# EAGLE design button_sensor_side (EAGLE 9.3.0)
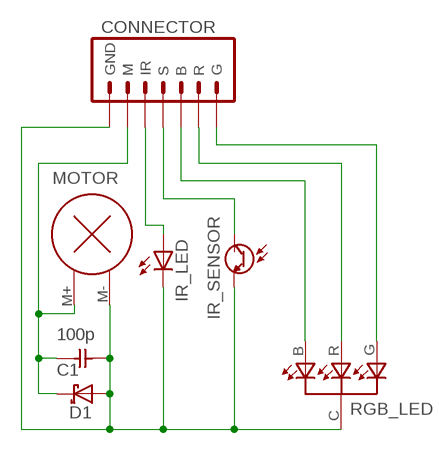
[diagram p0: schematic, sheet 1]

## Parts
C1  100p  CAPACITORSMD_0805  [C0805]
CONNECTOR  CONNECTOR_PADS  [CONNECTOR_PADS]
D1  DIODE_SCHOTTKY  [NSR0530HT1G_SCHOTTKY_DIODE]
IR_LED  TCR5000_EMITTER  [TCR5000_IR_EMITTER]
IR_SENSOR  TCR5000_SENSOR  [TCR5000_IR_SENSOR]
MOTOR  VIBRATION_MOTOR  [VIBRATION_MOTOR]
RGB_LED  APTF1616SEJ3ZGGVBDC_RBG_LED_SMT  [APTF1616SEJ3ZGGVBDC_RGB_LED_SMT]

## Nets
GND: C1.2 CONNECTOR.GND CONNECTOR.GND_(GND) D1.A IR_LED.C IR_SENSOR.E MOTOR.M-(-) RGB_LED.C
N$1: C1.1 CONNECTOR.M D1.C MOTOR.M+(+)
N$3: CONNECTOR.S IR_SENSOR.C
N$4: CONNECTOR.IR IR_LED.A
N$5: CONNECTOR.B RGB_LED.B(BLUE)
N$6: CONNECTOR.R RGB_LED.R(RED)
N$7: CONNECTOR.G RGB_LED.G(GREEN)

## Library data of the parts
C1 = Skinner_Box_Devices:CAPACITOR
CONNECTOR = Skinner_Box_Devices:CONNECTOR_PADS
D1 = Skinner_Box_Devices:DIODE_SCHOTTKY
IR_LED = Skinner_Box_Devices:TCR5000_EMITTER
IR_SENSOR = Skinner_Box_Devices:TCR5000_SENSOR
MOTOR = Skinner_Box_Devices:VIBRATION_MOTOR
RGB_LED = Skinner_Box_Devices:APTF1616SEJ3ZGGVBDC_RBG_LED_SMT

## Board
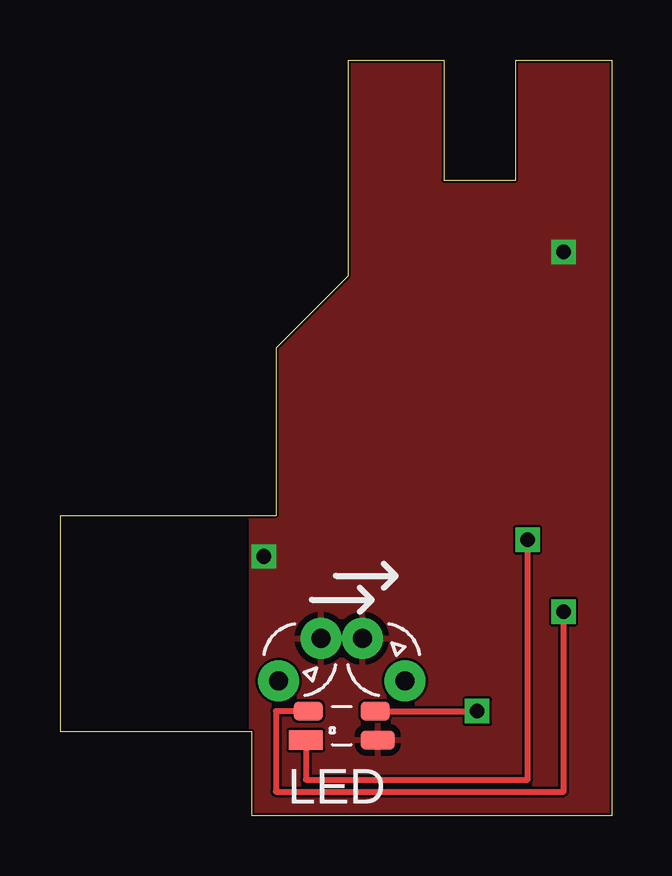
[diagram p1: board, top side]
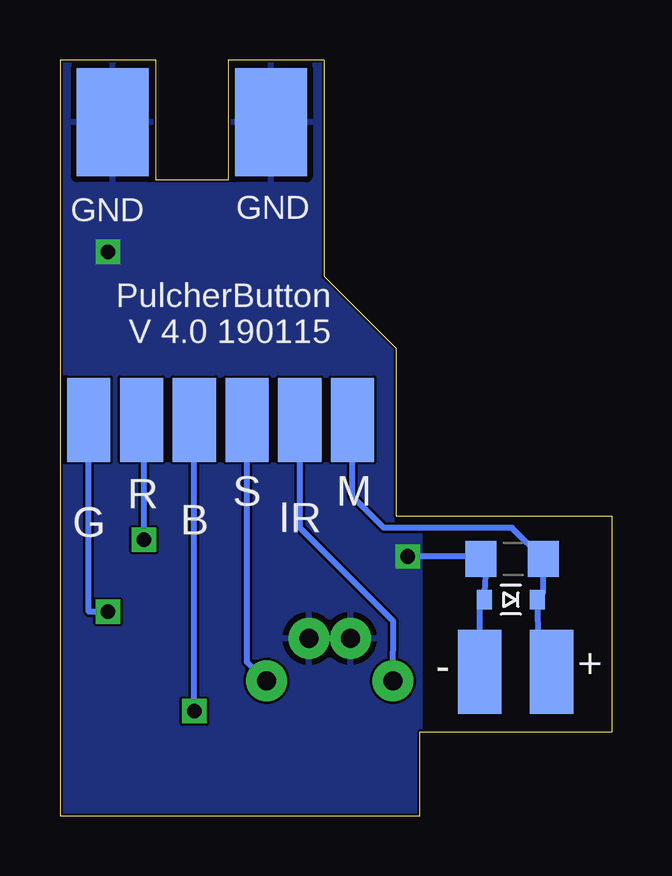
[diagram p2: board, bottom side, seen from below]

Size 23 x 31.5 mm. Coordinates in mm from the lower left corner, seen from the top.
Copper layers (1*16): Top 0.035mm / dielectric 1.5mm / Bottom 0.035mm
Design rules "eagle_design_rules_multiCB": minimum track width 0.1mm, minimum drill 24mil, track to track 0.1mm, track to pad 0.1mm, pad to pad 0.1mm, via to via 0.1mm, smd to smd 0.1mm, copper to edge 0.1mm, drill to drill 0.1mm, minimum pad ring 0mil, minimum via ring 8mil, stop-mask expansion 4mil, vias tented up to drill 1mm, thermal gap 10mil

### Footprints (pad centres in the part's own frame; a part is rotated, then mirrored left to right if it is on the bottom)
C0805 = smd 1.3 x 1.5: 1 -1.25,0; 2 1.35,0
CONNECTOR_PADS = smd 1.8 x 3.5 bottom: B 12.4,11; G 16.8,11; IR 8,11; M 5.8,11; R 14.6,11; S 10.2,11 | smd 3 x 4.5 bottom: GND 9.2,23.4; GND_ 15.8,23.4
NSR0530HT1G_SCHOTTKY_DIODE = smd 0.63 x 0.83: A 1.1,0; C -1.1,0
TCR5000_IR_EMITTER = drill 0.8 pad 1.7: A 0,1.25; C 0,-1.25
TCR5000_IR_SENSOR = drill 0.8 pad 1.7: C 0,1.25; E 0,-1.25
VIBRATION_MOTOR = smd 1.8 x 3.5 bottom: M+ -3.5,-18; M- -0.5,-18
APTF1616SEJ3ZGGVBDC_RGB_LED_SMT = smd 1.2 x 0.8: B 1.4,0.6; G -1.4,0.6 | smd 1.4 x 0.8: C 1.5,-0.6; R -1.5,-0.6

### Placement (x,y rotation side)
C1  4.1,10.7 180 bottom
CONNECTOR  5,5.5 0 top
D1  4.2,9 180 bottom
IR_LED  10,6.5 135 top
IR_SENSOR  13.5,6.5 225 top
MOTOR  6,24 0 top
RGB_LED  11.75,3.75 0 top

### Tracks (layer width: path | path; a pad name or v marks a point on that pad's centre or on a via)
GND  (via drill 0.61)
  Top 0.254: v8.5,10.8 8.9,10.8
  Bottom 0.254: 6.1,6 MOTOR.M- 5.5,8.8 D1.A 5.2,10.7 C1.2 5.2,11.2 5.2,10.8 v8.5,10.8
  other vias: 21,23.5
  pour Bottom: 8,12.5 9,12.5 9,19.5 12,22.5 12,31.5 16,31.5 16,26.5 19,26.5 19,31.5 23,31.5 23,0 8,0
  pour Top: 8,12.5 9,12.5 9,19.5 12,22.5 12,31.5 16,31.5 16,26.5 19,26.5 19,31.5 23,31.5 23,0 8,0
N$1
  Bottom 0.254: 10.5,16.5 CONNECTOR.M 10.8,13.3 9.5,12 4.15,12 C1.1 2.85,9.3 D1.C 3,6 MOTOR.M+
N$3
  Bottom 0.254: IR_SENSOR.C 15.2,6.4 CONNECTOR.S
N$4
  Bottom 0.254: IR_LED.A 9.1,8.1 13,12 CONNECTOR.IR
N$5  (via drill 0.61)
  Top 0.254: RGB_LED.B v17.4,4.35
  Bottom 0.254: v17.4,4.35 CONNECTOR.B
N$6  (via drill 0.61)
  Top 0.254: RGB_LED.R 10.25,1.5 19.5,1.5 v19.5,11.5
  Bottom 0.254: v19.5,11.5 19.5,16.5 CONNECTOR.R
N$7  (via drill 0.61)
  Top 0.254: RGB_LED.G 9,4.35 9,1 21,1 v21,8.5
  Bottom 0.254: v21,8.5 21.8,8.5 CONNECTOR.G

### Text on the board
tPlace: LED
bPlace: PulcherButton / V 4.0 190115